# EAGLE design tm7_revA (EAGLE 9.6.2)
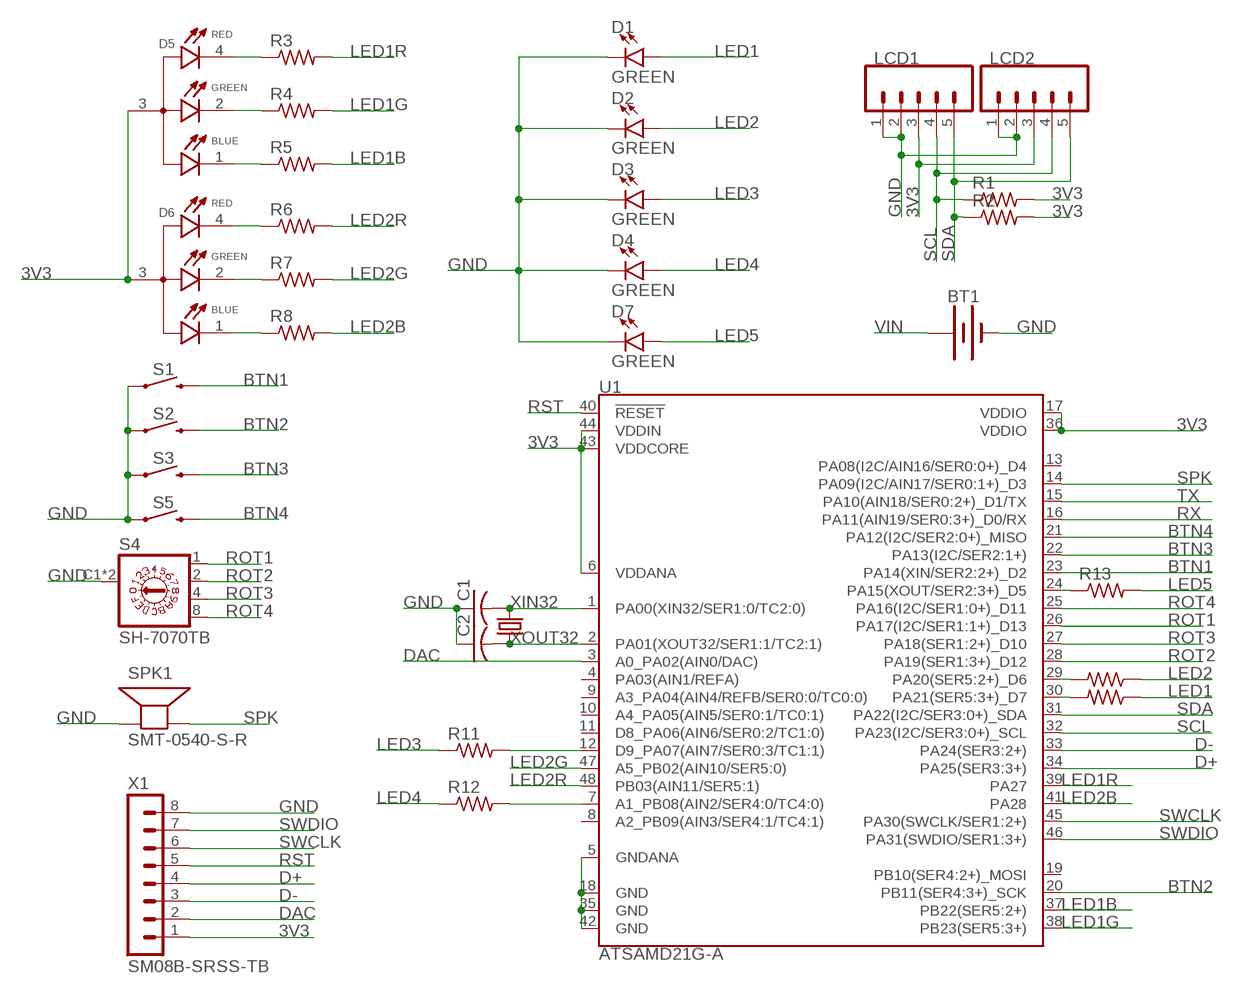
[diagram p0: schematic, sheet 1]

## Parts
BT1  BATTERY-20MM_SMD_4LEGS_OVERPASTE_INNER  [BATTCON_20MM_4LEGS_OVERPASTE_INNER]
C1  C-USC0603  [C0603]
C2  C-USC0603  [C0603]
D1  GREEN  LED-GREEN1206  [LED-1206]
D2  GREEN  LED-GREEN1206  [LED-1206]
D3  GREEN  LED-GREEN1206  [LED-1206]
D4  GREEN  LED-GREEN1206  [LED-1206]
D5  EAST1616RGBA3  [LED_EAST1616RGBA3]
D6  EAST1616RGBA3  [LED_EAST1616RGBA3]
D7  GREEN  LED-GREEN1206  [LED-1206]
LCD1  CONN_05VERT_FEMALE_HEADER  [1X05_SMD_VERTICAL_COMBO]
LCD2  CONN_05VERT_FEMALE_HEADER  [1X05_SMD_VERTICAL_COMBO]
R1  R-US_R0603  [R0603]
R2  R-US_R0603  [R0603]
R3  R-US_R0603  [R0603]
R4  R-US_R0603  [R0603]
R5  R-US_R0603  [R0603]
R6  R-US_R0603  [R0603]
R7  R-US_R0603  [R0603]
R8  R-US_R0603  [R0603]
R9  R-US_R0603  [R0603]
R10  R-US_R0603  [R0603]
R11  R-US_R0603  [R0603]
R12  R-US_R0603  [R0603]
R13  R-US_R0603  [R0603]
S1  MOMENTARY-SWITCH-SPST-SMD-6.0X3.5MM  [TACTILE_SWITCH_SMD_6.0X3.5MM]
S2  MOMENTARY-SWITCH-SPST-SMD-6.0X3.5MM  [TACTILE_SWITCH_SMD_6.0X3.5MM]
S3  MOMENTARY-SWITCH-SPST-SMD-6.0X3.5MM  [TACTILE_SWITCH_SMD_6.0X3.5MM]
S4  SH-7070TB  [SH-7070B]
S5  MOMENTARY-SWITCH-SPST-SMD-6.0X3.5MM  [TACTILE_SWITCH_SMD_6.0X3.5MM]
SPK1  SMT-0540-S-R  [SMT-0540-S-R]
U1  ATSAMD21G-A  [TQFP-48]
X1  SM08B-SRSS-TB  [SM08B-SRSS-TB]
Y1  32.768kHz  CRYSTAL-32.768KHZSMD-3.2X1.5  [CRYSTAL-SMD-3.2X1.5MM]

## Nets
3V3: D5.3(A) D6.3(A) LCD1.3 LCD2.3 R1.2 R2.2 U1.6(VDDANA) U1.17(VDDIO) U1.36(VDDIO) U1.43(VDDCORE) U1.44(VDDIN) X1.1
BTN1: S1.2 U1.23(PA14(XIN/SER2:2+)_D2)
BTN2: S2.2 U1.20(PB11(SER4:3+)_SCK)
BTN3: S3.2 U1.22(PA13(I2C/SER2:1+))
BTN4: S5.2 U1.21(PA12(I2C/SER2:0+)_MISO)
D+: U1.34(PA25(SER3:3+)) X1.4
D-: U1.33(PA24(SER3:2+)) X1.3
DAC: U1.3(A0_PA02(AIN0/DAC)) X1.2
GND: BT1.2(-) C1.1 C2.1 D1.C D2.C D3.C D4.C D7.C LCD1.1 LCD1.2 LCD2.1 LCD2.2 S1.1 S2.1 S3.1 S4.C1(C) S4.C2(C) S5.1 SPK1.-(+) U1.5(GNDANA) U1.18(GND) U1.35(GND) U1.42(GND) X1.8
LED1: D1.A R9.1
LED1B: R5.2 U1.37(PB22(SER5:2+))
LED1G: R4.2 U1.38(PB23(SER5:3+))
LED1R: R3.2 U1.39(PA27)
LED2: D2.A R10.1
LED2B: R8.2 U1.41(PA28)
LED2G: R7.2 U1.47(A5_PB02(AIN10/SER5:0))
LED2R: R6.2 U1.48(PB03(AIN11/SER5:1))
LED3: D3.A R11.1
LED4: D4.A R12.1
LED5: D7.A R13.2
N$1: R12.2 U1.7(A1_PB08(AIN2/SER4:0/TC4:0))
N$2: R11.2 U1.12(D9_PA07(AIN7/SER0:3/TC1:1))
N$3: R9.2 U1.30(PA21(SER5:3+)_D7)
N$4: R10.2 U1.29(PA20(SER5:2+)_D6)
N$5: D5.4(R_C) R3.1
N$6: D5.2(G_C) R4.1
N$7: D5.1(B_C) R5.1
N$8: D6.4(R_C) R6.1
N$9: D6.2(G_C) R7.1
N$10: D6.1(B_C) R8.1
N$11: R13.1 U1.24(PA15(XOUT/SER2:3+)_D5)
ROT1: S4.1 U1.26(PA17(I2C/SER1:1+)_D13)
ROT2: S4.2 U1.28(PA19(SER1:3+)_D12)
ROT3: S4.4 U1.27(PA18(SER1:2+)_D10)
ROT4: S4.8 U1.25(PA16(I2C/SER1:0+)_D11)
RST: U1.40(!RESET!) X1.5
RX: U1.16(PA11(AIN19/SER0:3+)_D0/RX)
SCL: LCD1.4 LCD2.4 R1.1 U1.32(PA23(I2C/SER3:0+)_SCL)
SDA: LCD1.5 LCD2.5 R2.1 U1.31(PA22(I2C/SER3:0+)_SDA)
SPK: SPK1.+(-) U1.14(PA09(I2C/AIN17/SER0:1+)_D3)
SWCLK: U1.45(PA30(SWCLK/SER1:2+)) X1.6
SWDIO: U1.46(PA31(SWDIO/SER1:3+)) X1.7
TX: U1.15(PA10(AIN18/SER0:2+)_D1/TX)
VIN: BT1.1(+)
XIN32: C1.2 U1.1(PA00(XIN32/SER1:0/TC2:0)) Y1.P$2
XOUT32: C2.2 U1.2(PA01(XOUT32/SER1:1/TC2:1)) Y1.P$1
Unconnected: U1.4(PA03(AIN1/REFA)) U1.8(A2_PB09(AIN3/SER4:1/TC4:1)) U1.9(A3_PA04(AIN4/REFB/SER0:0/TC0:0)) U1.10(A4_PA05(AIN5/SER0:1/TC0:1)) U1.11(D8_PA06(AIN6/SER0:2/TC1:0)) U1.13(PA08(I2C/AIN16/SER0:0+)_D4) U1.19(PB10(SER4:2+)_MOSI)

## Library data of the parts
BT1 = SparkFun-Batteries:BATTERY: Battery - Single Cell A variety of battery chemistries, sizes, and footprints. Device List: 20MM_PTH - Coin Cell Battery Holder - 20mm (PTH) <https://www.sparkfun.com/products/783> 20MM_PTH_KIT- Coin Cell battery Holder - 20 mm (PTH) <http://www.sparkfun.com/products/783>kit version with special mask 6.8MM_PTH - Coin Cell Battery Holder - 6.8MM(SMD) <https://www.digikey.com/product-detail/en/seiko-instruments/MS621FE-FL11E/728-1057-ND/1889208?WT.srch=1&gclid=CNOQ5a6LzdQCFZS2wAodXCkE0g> 12MM_SMD - Coin Cell Battery Holder - 12mm (SMD) <https://www.sparkfun.com/products/10592> 12MM_PTH - Coin Cell Battery Holder - 12mm (PTH) <https://www.sparkfun.com/products/7948> 20MM_SMD - 20mm Coin Cell Battery Holder (SMD) (2 legs) Used on the Big Time Watch Kit <https://www.sparkfun.com/products/11734> 20MM_SMD_4LEGS - Coin Cell Battery Holder - 20mm (SMD) <https://www.sparkfun.com/products/11892> 20MM_SMD_4LEGS_OVERPASTE - Coin Cell Battery Holder - 20mm (SMD) <https://www.sparkfun.com/products/11892> (Over-paste on the legs) 24.5MM_PTH - Coin Cell Battery Holder - 24.5mm (PTH) <https://www.sparkfun.com/products/8863> 9V - 9V Battery Holder - PC Mount Used on the SparkFun SparkPunk Sound Kit <https://www.sparkfun.com/products/11177> and SparkFun SparkPunk Sequencer Kit <https://www.sparkfun.com/products/12707> 18650 - Battery Holder - 18650 (PTH) <https://www.sparkfun.com/products/13113> AA - Battery Holder - 1xAA (PTH) <https://www.sparkfun.com/products/7949> AAA - Battery Holder - 1xAAA (PTH) <https://www.sparkfun.com/products/12718> AA_KIT - Battery Holder - 1xAA (PTH) <https://www.sparkfun.com/products/7949> Special kit package - pads only have exposed copper on one side of the board. AAA_KIT - Battery Holder - 1xAAA (PTH) <https://www.sparkfun.com/products/12718> Special kit package - pads only have exposed copper on one side of the board.
C1 C2 = adafruit:C-US: CAPACITOR, American symbol
D1-D4 D7 = SparkFun-LED:LED-GREEN: Green SMD LED Used in manufacturing of various products at SparkFun Packages: 0603 - SMD 0603 package [Product Link] <http://www.futureelectronics.com/en/technologies/semiconductors/optoelectronics/leds/Pages/9894312-LTST-C190GKT.aspx?CrossPart=HSMG-C190&IM=0> LilyPad 1206 - SMD1206 LilyPad package [Product Link] <http://www.futureelectronics.com/en/Technologies/Product.aspx?ProductID=IN150NGHARVATEKCORPORATION2049943&IM=0> 1206 - SMD1206 package [Product Link] <http://www.futureelectronics.com/en/technologies/semiconductors/optoelectronics/leds/Pages/8315665-LTST-C150KGKT.aspx?IM=0> 1206 Bottom Mount -SMD 1206 Bottom Mount [Product Link] <http://www.digikey.com/product-detail/en/lite-on-inc/LTST-C230KGKT/160-1456-1-ND/386854> SparkFun Products: Pro Mini 328 -5V <https://www.sparkfun.com/products/821> RedBoard <https://www.sparkfun.com/products/12757> MP3 Trigger <https://www.sparkfun.com/products/13720> Makey Makey <https://www.sparkfun.com/products/11076>; PROD_ID: DIO-00862
D5 D6 = EAST1616RGBA3:EAST1616RGBA3: Red, Green, Blue (RGB) LED Indication - Discrete 1.95V Red, 2.8V Green, 2.8V Blue 0606 (1616 Metric) Check availability <https://pricing.snapeda.com/parts/EAST1616RGBA3/Everlight%20Electronics/view-part?ref=eda>; AVAILABILITY: In Stock; DESCRIPTION: Red, Green, Blue (RGB) - LED Indication - Discrete 1.95V Red, 2.8V Green, 2.8V Blue 0606 (1616 Metric); MF: Everlight Electronics; MP: EAST1616RGBA3; PACKAGE: 0606 Everlight; PRICE: None; PURCHASE-URL: https://pricing.snapeda.com/search/part/EAST1616RGBA3/?ref=eda
LCD1 LCD2 = SparkFun-Connectors:CONN_05: Multi connection point. Often used as Generic Header-pin footprint for 0.1 inch spaced/style header connections On any of the 0.1 inch spaced packages, you can populate with these: Break Away Headers - Straight <https://www.sparkfun.com/products/116> (PRT-00116) Break Away Male Headers - Right Angle <https://www.sparkfun.com/products/553> (PRT-00553) Female Headers <https://www.sparkfun.com/products/115> (PRT-00115) Break Away Headers - Machine Pin <https://www.sparkfun.com/products/117> (PRT-00117) Break Away Female Headers - Swiss Machine Pin <https://www.sparkfun.com/products/743> (PRT-00743) For SCREWTERMINALS and SPRING TERMINALS visit here: Screw Terimnals on SparkFun.com <https://www.sparkfun.com/search/results?term=Screw+Terminals> (5mm/3.5mm/2.54mm spacing) This device is also useful as a general connection point to wire up your design to another part of your project. Our various solder wires solder well into these plated through hole pads. Hook-Up Wire - Assortment (Stranded, 22 AWG) <https://www.sparkfun.com/products/11375> (PRT-11375) Hook-Up Wire - Assortment (Solid Core, 22 AWG) <https://www.sparkfun.com/products/11367> (PRT-11367) View the entire wire category on our website here <https://www.sparkfun.com/categories/141> Special notes: Molex polarized connector foot print use with SKU : PRT-08231 with associated crimp pins and housings. 1MM SMD Version SKU: PRT-10208; PROD_ID: CONN-15262
R1-R13 = rcl:R-US_: RESISTOR, American symbol; SPICEPREFIX: R
S1-S3 S5 = SparkFun-Switches:MOMENTARY-SWITCH-SPST: Momentary Switch (Pushbutton) - SPST Normally-open (NO) SPST momentary switches (buttons, pushbuttons). Variants PTH-12MM - 12mm square, through-hole Momentary Pushbutton Switch - 12mm Square <https://www.sparkfun.com/products/9190> (COM-09190) PTH-6.0MM, PTH-6.0MM-KIT - 6.0mm square, through-hole Mini Pushbutton Switch <https://www.sparkfun.com/products/97> (COM-00097) KIT package intended for soldering kit's - only one side of pads' copper is exposed. PTH-RIGHT-ANGLE-KIT - Right-angle, through-hole Right Angle Tactile Button <https://www.sparkfun.com/products/10791> - Used on SparkFun BigTime Watch Kit <https://www.sparkfun.com/products/11734> SMD-12MM - 12mm square, surface-mount Tactile Button - SMD (12mm) <https://www.sparkfun.com/products/12993> (COM-12993) Used on SparkFun PicoBoard <https://www.sparkfun.com/products/11888> SMD-4.5MM - 4.5mm Square Trackball Switch Used on SparkFun Blackberry Trackballer Breakout <https://www.sparkfun.com/products/13169> SMD-4.6MMX2.8MM - 4.60mm x 2.80mm, surface mount Used on SparkFun Pro Micro - RP2040 <https://www.sparkfun.com/products/17717> SMD-5.2MM, SMD-5.2-REDUNDANT - 5.2mm square, surface-mount Mini Pushbutton Switch - SMD <https://www.sparkfun.com/products/8720> (COM-08720) Used on Arduino Pro Mini <https://www.sparkfun.com/products/11114> REDUNDANT package connects both switch circuits together SMD-6.0X3.5MM - 6.0 x 3.5mm, surface mount Momentary Reset Switch SMD <https://www.sparkfun.com/products/8229> (COM-08229) SMD-6.2MM-TALL - 6.2mm square, surface mount Tactile Button - SMD (6mm) <https://www.sparkfun.com/products/12992> Used on SparkFun Digital Sandbox <https://www.sparkfun.com/products/12651> SMD-RIGHT-ANGLE - Right-angle, surface mount Used on SparkFun Block for Intel® Edison - Arduino <https://www.sparkfun.com/products/13036>; PROD_ID: SWCH-14278; SF_SKU: COM-08229
S4 = SH-7070TB:SH-7070TB: ROTARY CODED HEX SWITCH Check availability <https://pricing.snapeda.com/parts/SH-7070TB/Nidec%20Copal/view-part?ref=eda>; AVAILABILITY: In Stock; DESCRIPTION: Dip Switch Hexadecimal Complement 16 Position Surface Mount Rotary for Tool Actuator 100mA 5VDC; MF: Nidec Copal; MP: SH-7070TB; PACKAGE: None; PRICE: None; PURCHASE-URL: https://pricing.snapeda.com/search/part/SH-7070TB/?ref=eda
SPK1 = SMT-0540-S-R:SMT-0540-S-R: SMT-0549-S-R Small surface-mount magnetic buzzer Check availability <https://pricing.snapeda.com/parts/SMT-0540-S-R/PUI/view-part?ref=eda>; AVAILABILITY: In Stock; DESCRIPTION: SURFACE MOUNT TRANSDUCER 3V0-P 100MA; MF: PUI; MP: SMT-0540-S-R; PACKAGE: None; PRICE: None; PURCHASE-URL: https://pricing.snapeda.com/search/part/SMT-0540-S-R/?ref=eda
U1 = SparkFun-IC-Microcontroller:ATSAMD21G: Atmel SAMD21G SMART ARM-Based Microcontroller The Atmel ® | SMART ™ SAM D21 is a series of low-power microcontrollers using the 32-bit ARM ® Cortex ® -M0+ processor, and ranging from 32- to 64-pins with up to 256KB Flash and 32KB of SRAM. The SAM D21 devices operate at a maximum frequency of 48MHz and reach 2.46 CoreMark/MHz. They are designed for simple and intuitive migration with identical peripheral modules, hex compatible code, identical linear address map and pin compatible migration paths between all devices in the product series. All devices include intelligent and flexible peripherals, Atmel Event System for inter-peripheral signaling, and support for capacitive touch button, slider and wheel user interfaces. Datasheet <https://cdn.sparkfun.com/datasheets/Dev/Arduino/Boards/Atmel-42181-SAM-D21_Datasheet.pdf> SparkFun Products SparkFun SAMD21 Mini Breakout <https://www.sparkfun.com/products/13664> (DEV-13664) SparkFun SAMD21 Dev Breakout <https://www.sparkfun.com/products/13672> (DEV-13672) (DEV-14926); PROD_ID: IC-13064
X1 = con-JST:SM08B-SRSS: JST SH series header 1.00mm pitch disconnectable crimp style connectors, horizontal (side entry type), 8 pins
Y1 = SparkFun-Clocks:CRYSTAL-32.768KHZ: 32.768kHz Crystal Frequency: 32.768kHz Frequency Stability: ±20ppm Load Capacitance: 12.5pF (PTH-2X6 & SMD-3.2X1.5), 6pF (SMD-2X6) SparkFun Products: SparkFun BigTime Watch Kit <https://www.sparkfun.com/products/11734> SparkFun nRF52832 Breakout <https://www.sparkfun.com/products/13990> SparkFun Real Time Clock Module <https://www.sparkfun.com/products/12708>; PROD_ID: XTAL-13062

## Board
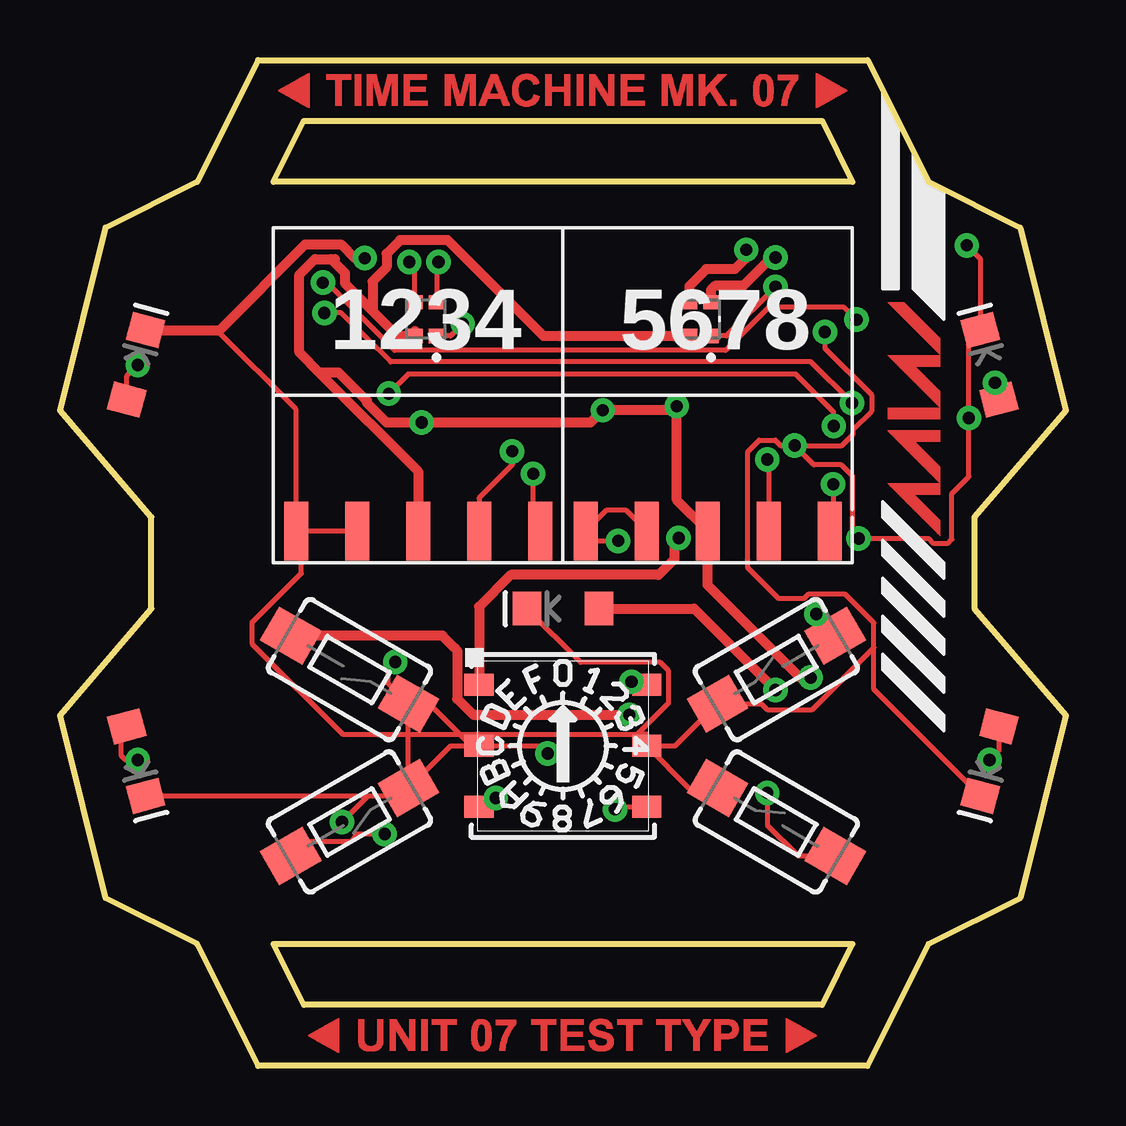
[diagram p1: board, top side]
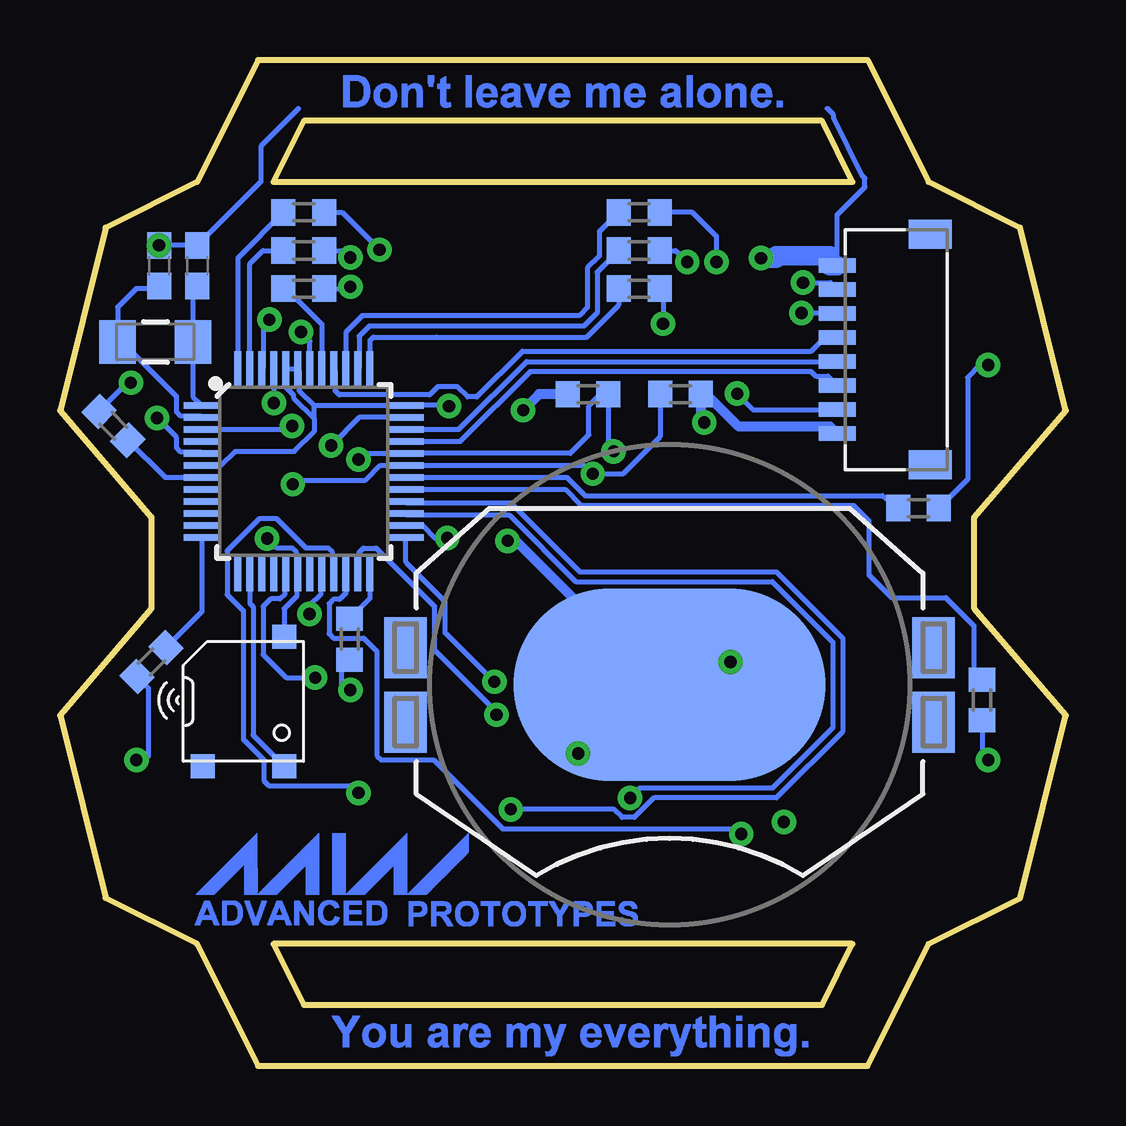
[diagram p2: board, bottom side, seen from below]

Size 41.91 x 41.91 mm. Coordinates in mm from the lower left corner, seen from the top.
Outline: 33.66,0 8.25,0 5.71,5.08 1.9,6.98 0,14.61 3.81,19.05 3.81,22.86 0,27.3 1.9,34.92 5.71,36.83 8.25,41.91 33.66,41.91 36.19,36.83 40,34.92 41.91,27.3 38.1,22.86 38.1,19.05 41.91,14.61 40,6.98 36.19,5.08 33.66,0
Outline: 8.89,36.83 10.16,39.37 31.75,39.37 33.02,36.83 8.89,36.83
Outline: 33.02,5.08 31.75,2.54 10.16,2.54 8.89,5.08 33.02,5.08
Copper layers (1*16): Top 0.035mm / dielectric 1.5mm / Bottom 0.035mm
Design rules "SparkFun": minimum track width 8mil, minimum drill 20mil, track to track 8mil, track to pad 8mil, pad to pad 8mil, via to via 8mil, smd to smd 8mil, copper to edge 10mil, drill to drill 8mil, minimum pad ring 12mil, minimum via ring 10mil, stop-mask expansion 4mil, vias tented up to drill 25mil, thermal gap 10mil

### Footprints (pad centres in the part's own frame; a part is rotated, then mirrored left to right if it is on the bottom)
BATTCON_20MM_4LEGS_OVERPASTE_INNER = smd 1.778 x 2.54: 1 -11,1.55; 3 11,1.55; P$1 -11,-1.55; P$2 11,-1.55 | smd 13 x 8: 2 0,0
C0603 = smd 1.1 x 1: 1 -0.85,0; 2 0.85,0
LED-1206 = smd 1.2 x 1.4: A -1.5,0; C 1.5,0
LED_EAST1616RGBA3 = smd 0.6 x 0.65: 1 0.7,0.45; 2 -0.7,0.45; 3 0.7,-0.45; 4 -0.7,-0.45
1X05_SMD_VERTICAL_COMBO = smd 1 x 2.438: 1 0,1.65; 2 2.54,1.65; 3 5.08,1.65; 4 7.62,1.652; 5 10.16,1.65
R0603 = smd 1 x 1.1: 1 -0.85,0; 2 0.85,0
TACTILE_SWITCH_SMD_6.0X3.5MM = smd 2.032 x 1.626: 1 -2.833,0; 2 2.833,0
SH-7070B = smd 1.219 x 0.914: 1 -2.223,3.81; 2 4.763,-1.27; 4 -2.223,-1.27; 8 4.763,3.81; C1 -2.223,1.27; C2 4.763,1.27
SMT-0540-S-R = smd 1 x 1: + 1.7,-2.7; - 1.7,2.7; M -1.7,-2.7
TQFP-48 = smd 1.5 x 0.28: 1 -4.25,2.75; 2 -4.25,2.25; 3 -4.25,1.75; 4 -4.25,1.25; 5 -4.25,0.75; 6 -4.25,0.25; 7 -4.25,-0.25; 8 -4.25,-0.75; 9 -4.25,-1.25; 10 -4.25,-1.75; 11 -4.25,-2.25; 12 -4.25,-2.75; 25 4.25,-2.75; 26 4.25,-2.25; 27 4.25,-1.75; 28 4.25,-1.25; 29 4.25,-0.75; 30 4.25,-0.25; 31 4.25,0.25; 32 4.25,0.75; 33 4.25,1.25; 34 4.25,1.75; 35 4.25,2.25; 36 4.25,2.75 | smd 0.28 x 1.5: 13 -2.75,-4.25; 14 -2.25,-4.25; 15 -1.75,-4.25; 16 -1.25,-4.25; 17 -0.75,-4.25; 18 -0.25,-4.25; 19 0.25,-4.25; 20 0.75,-4.25; 21 1.25,-4.25; 22 1.75,-4.25; 23 2.25,-4.25; 24 2.75,-4.25; 37 2.75,4.25; 38 2.25,4.25; 39 1.75,4.25; 40 1.25,4.25; 41 0.75,4.25; 42 0.25,4.25; 43 -0.25,4.25; 44 -0.75,4.25; 45 -1.25,4.25; 46 -1.75,4.25; 47 -2.25,4.25; 48 -2.75,4.25
SM08B-SRSS-TB = smd 0.6 x 1.55: 1 3.5,0; 2 2.5,0; 3 1.5,0; 4 0.5,0; 5 -0.5,0; 6 -1.5,0; 7 -2.5,0; 8 -3.5,0 | smd 1.2 x 1.8: M1 4.8,3.875; M2 -4.8,3.875
CRYSTAL-SMD-3.2X1.5MM = smd 1.524 x 1.8: P$1 -1.567,0; P$2 1.567,0

### Placement (x,y rotation side)
BT1  16.51,15.88 0 bottom
C1  36.19,33.34 270 bottom
C2  37.78,33.34 270 bottom
D1  3.18,29.21 75 top
D2  3.18,12.7 285 top
D3  38.73,12.7 255 top
D4  38.73,29.21 105 top
D5  15.24,31.12 270 top
D6  26.67,31.12 270 top
D7  20.96,19.05 180 top
LCD1  9.84,20.64 0 top
LCD2  21.91,20.64 0 top
R1  19.91,27.98 180 bottom
R2  16.06,27.99 0 bottom
R3  17.78,35.56 180 bottom
R4  17.78,33.97 180 bottom
R5  17.78,32.38 180 bottom
R6  31.75,35.56 180 bottom
R7  31.75,33.97 180 bottom
R8  31.75,32.38 180 bottom
R9  6.14,23.24 180 bottom
R10  3.49,15.24 90 bottom
R11  38.1,16.83 45 bottom
R12  39.69,26.67 315 bottom
R13  29.85,17.78 270 bottom
S1  12.06,16.51 150 top
S2  29.85,16.51 30 top
S3  12.06,10.16 210 top
S4  19.68,12.07 0 top
S5  29.85,10.16 330 top
SPK1  34.27,15.18 0 bottom
U1  31.75,24.77 0 bottom
X1  9.52,29.84 270 bottom
Y1  37.94,30.16 0 bottom

### Tracks (layer width: path | path; a pad name or v marks a point on that pad's centre or on a via)
3V3  (via drill 0.51)
  Top 0.203: 14.66,30.41 D5.3 | v31.28,16.17 30.84,16.17
  Top 0.406: 11.3,33.62 10.62,33.62 9.97,32.97 9.97,29.72 10.81,28.89 | 11.3,33.62 11.46,33.62 | 10.81,28.89 14.92,24.77 LCD1.3 | 30.84,16.17 26.99,20.03 LCD2.3 25.7,23.58 v25.7,27.49 25.53,27.32 v22.61,27.32 22.1,26.8 v15.07,26.8 13.61,26.8 12.78,27.63 12.78,27.72 11.61,28.89 10.81,28.89 | 14.79,30.62 D5.3 14.06,30.41 13.03,31.45 | D6.3 20.14,30.41 16.15,34.4 14.18,34.4 13.61,33.84 13.61,33.28 13.03,32.69 13.03,31.45 | 11.3,33.62 11.87,33.05 11.87,32.61 13.03,31.45
  Bottom 0.203: v25.7,27.49 25.87,27.49 25.9,27.52 U1.36 31.32,27.52 | 32.5,19.83 U1.17 32.55,20.46 32.55,19.64 32.73,19.46 33.13,19.46 33.44,19.14 33.44,17.14 32.48,16.17 v31.28,16.17 | 31.32,27.52 31.94,28.14 31.94,28.96 U1.43 U1.44 32.5,28.27 32.19,27.96 32.19,27.84 31.32,26.98 | 31.32,26.98 31.32,26.42 32.14,25.6 34.61,25.6 35.2,25.02 U1.6 | 31.32,26.98 31.32,27.52
  Bottom 0.406: R1.2 21.95,27.98 v22.61,27.32 | X1.1 9.82,26.64 13.62,26.64 14.97,27.99 R2.2 15.21,26.94 v15.07,26.8
BTN1  (via drill 0.51)
  Top 0.203: 16.45,17.41 16.55,17.31
  Top 0.406: v23.72,14.63 17.21,14.63 16.55,15.29 16.55,17.31 | S1.2 15.93,17.93 16.45,17.41
  Bottom 0.203: v23.72,14.63 23.72,14.74 26.32,17.33 26.32,19.15 28.73,21.57 29.27,21.57 29.44,21.39 29.44,20.57 U1.23
BTN2  (via drill 0.51)
  Top 0.203: v31.51,18.83 32.3,18.05 S2.2
  Bottom 0.203: U1.20 31.05,20.46 31.05,19.64 31.51,19.18 v31.51,18.83
BTN3  (via drill 0.51)
  Top 0.203: v13.53,9.66 12.39,9.66 12.08,9.35 10.21,9.35 S3.2
  Bottom 0.203: v13.53,9.66 13.74,9.87 23.46,9.87 26.34,12.75 28.53,12.75 28.7,12.93 28.7,17.27 29.26,17.82 30.52,17.82 30.7,18 30.7,19.26 30.52,19.43 30.26,19.43 30,19.69 U1.22
BTN4  (via drill 0.51)
  Top 0.203: v29.47,11.37 29.47,10.03 30.75,8.74 S5.2
  Bottom 0.203: U1.21 30.55,20.57 30.55,21.39 30.73,21.57 31.66,21.57 32.88,22.79 33.61,22.79 34.94,21.46 34.94,19.64 34.27,18.96 34.27,13.6 33.41,12.74 33.41,11.89 33.2,11.68 29.78,11.68 v29.47,11.37
D+
  Bottom 0.203: U1.34 25.3,26.52 22.47,29.34 X1.4
D-
  Bottom 0.203: U1.33 25.23,26.02 22.3,28.94 10.62,28.94 10.43,28.74 9.92,28.74 X1.3
DAC  (via drill 0.51)
  Top 0.203: v32.24,26.66 32.24,27.24 30.66,28.82 14.51,28.82 v13.7,28.01
  Bottom 0.203: U1.3 32.38,26.52 v32.24,26.66 | v13.7,28.01 13.04,27.34 X1.2
GND  (via drill 0.51)
  Top 0.203: v31.87,30.58 31.87,29.9 33.81,27.96 33.81,27.28 33.05,26.52 33.05,26.32 32.58,25.84 v30.61,25.84 | LCD2.2 23.59,23.15 22.76,23.15 LCD2.1 22.32,21.87 v23.26,21.87 | LCD1.1 LCD1.2 12.77,22.29 | C2.1 38.35,33.62 D4.C 37.87,30.18 v37.87,26.99 37.87,24.55 37.16,23.84 37.16,21.94 36.98,21.76 36.41,21.76 36.19,21.98 v33.28,21.98 33.03,22.23 33.03,24.57 32.55,25.04 31.41,25.04 v30.61,25.84 | S4.C2 25.63,13.34 S2.1 29.23,15.09 29.48,14.85 31.33,14.85 33.91,17.42 | S3.1 14.52,14.92 | 14.52,14.92 S1.1 13.65,15.96 13.65,16.51 v13.97,16.83 | S3.1 16.28,13.34 S4.C1 | D2.C 12.84,11.25 | S3.1 14.19,11.25 12.84,11.25 | v30.61,25.84 30.04,25.84 29.81,26.07 29.13,26.07 28.66,25.6 28.66,20.75 29.94,19.46 31,19.46 31.18,19.64 32.73,19.64 33.91,18.46 33.91,17.42 | 17.46,13.82 11.78,13.82 8,17.59 8,18.46 10.06,20.52 10.06,22.07 LCD1.1 | 17.46,13.82 24.06,13.82 | 24.06,13.82 25.36,15.12 25.36,16.46 25.01,16.82 21.69,16.82 D7.C | S4.C1 17.46,13.82 | S4.C2 24.45,13.82 24.06,13.82 | 14.52,14.92 15.56,14.92 17.14,13.34 S4.C1 | S4.C1 20,13.34 v20.32,13.02 | v11.75,10.16 12.84,11.25 | S4.C2 26.21,11.58 S5.1 | 38.02,11.58 D3.C 33.91,15.69 33.91,17.42 | LCD1.1 9.84,27.35 6.53,30.66 D1.C
  Top 0.406: v12.7,33.66 12.29,33.66 11.71,34.23 10.22,34.23 6.65,30.66 D1.C
  Bottom 0.203: U1.42 31.5,30.2 v31.87,30.58 | X1.8 9.52,35.46 8.37,36.61 8.37,36.99 8.49,37.12 9.68,39.48 9.68,39.62 9.94,39.89 | 31.97,39.89 33.54,38.32 33.54,36.84 C1.1 C2.1 | U1.5 36.05,25.57 36.88,25.57 37.05,25.75 37.05,26.18 v37.87,26.99 | v33.28,21.98 32.87,21.57 32.23,21.57 32.05,21.39 32.05,20.57 U1.18 32.05,20.46 32.05,19.56 32.57,19.05 SPK1.- | U1.35 29.44,27.02 v30.61,25.84 | 15.24,15.24 15.87,15.88 BT1.2 15.56,16.83 v13.97,16.83
  Bottom 0.406: v23.26,21.87 22.91,21.87 18.63,17.59 18.22,17.59 BT1.2
  Bottom 0.813: X1.8 9.84,33.34 9.84,33.75 12.07,33.75 12.07,33.66 v12.7,33.66
  other vias: 37.78,34.19
LED1  (via drill 0.51)
  Top 0.203: D1.A 2.79,28.75 v3.24,29.2
  Bottom 0.203: v3.24,29.2 3.58,29.2 4.1,28.69 4.1,24.44 R9.1
LED1B
  Bottom 0.203: R5.2 18.63,31.7 19.97,30.36 26.21,30.36 28.86,30.36 29,30.22 U1.37
LED1G
  Bottom 0.203: U1.38 29.44,29.07 29.44,30.41 29.03,30.82 20.08,30.82 19.53,31.38 19.53,33.08 R4.2
LED1R
  Bottom 0.203: U1.39 30,30.56 29.29,31.27 20.26,31.27 19.93,31.6 19.93,33.24 19.43,33.74 19.43,34.76 R3.2
LED2  (via drill 0.51)
  Top 0.203: v3.24,12.74 2.72,12.74 2.55,12.92 2.55,13.91 D2.A
  Bottom 0.203: R10.1 3.49,13 v3.24,12.74
LED2B
  Bottom 0.203: R8.2 32.48,32.38 31,30.91 U1.41
LED2G
  Bottom 0.203: U1.47 34,33.43 33.46,33.97 R7.2
LED2R
  Bottom 0.203: R6.2 34.5,33.66 U1.48
LED3  (via drill 0.51)
  Top 0.203: D3.A 39.12,13.14 v38.73,12.74
  Bottom 0.203: v38.73,12.74 38.39,12.74 38.21,12.92 38.21,15.74 R11.1
LED4  (via drill 0.51)
  Top 0.203: D4.A 39.12,28.3 v38.96,28.46
  Bottom 0.203: v38.96,28.46 39.1,28.46 R12.1
LED5  (via drill 0.51)
  Top 0.406: D7.A 26.42,19.05 v29.81,15.66
  Bottom 0.203: v29.81,15.66 29.98,15.66 30.19,15.86 30.19,16.59 R13.2
N$1
  Bottom 0.203: R12.2 37.53,24.52 U1.7
N$2
  Bottom 0.203: U1.12 36,18.93 R11.2
N$3
  Bottom 0.203: U1.30 20.79,24.52 20.03,23.76 7.64,23.76 R9.2
N$4
  Bottom 0.203: U1.29 20.86,24.02 20.2,23.35 8.85,23.35 8.21,22.72 8.21,20.46 7.26,19.51 5,19.51 3.84,18.34 3.84,16.43 R10.2
N$5  (via drill 0.51)
  Top 0.203: D5.4 14.79,33.25 v14.55,33.49
  Bottom 0.203: v14.55,33.49 14.55,34.56 15.56,35.56 R3.1
N$6  (via drill 0.51)
  Top 0.203: v15.77,33.49 15.69,33.41 D5.2
  Bottom 0.203: R4.1 16.26,33.97 v15.77,33.49
N$7  (via drill 0.51)
  Top 0.203: v16.78,30.92 16.28,30.41 D5.1
  Bottom 0.203: R5.1 16.78,32.24 v16.78,30.92
N$8  (via drill 0.51)
  Top 0.406: v28.59,34 28.59,33.66 28.12,33.19 26.93,33.19 26.22,32.48 D6.4
  Bottom 0.203: R6.1 30.15,35.56 v28.59,34
N$9  (via drill 0.51)
  Top 0.406: v29.81,33.68 29.64,33.68 28.46,32.5 27.29,32.5 27.12,32.33 D6.2
  Bottom 0.203: R7.1 30.11,33.97 v29.81,33.68
N$10  (via drill 0.51)
  Top 0.203: v29.81,32.46 27.77,30.41 D6.1
  Bottom 0.203: R8.1 29.89,32.38 v29.81,32.46
N$11
  Bottom 0.203: U1.24 29,19.48 R13.1
ROT1  (via drill 0.51)
  Top 0.406: v25.78,21.99 25.6,21.81 25.6,21.11 24.94,20.46 18.79,20.46 17.46,19.13 S4.1
  Bottom 0.203: U1.26 26.81,22.52 26.29,21.99 v25.78,21.99
ROT2  (via drill 0.51)
  Top 0.203: v23.13,10.69 23.23,10.8 S4.2
  Bottom 0.203: U1.28 27.44,23.46 23.12,23.46 20.25,20.59 12.06,20.59 9.3,17.83 9.3,13.92 12.06,11.16 17.16,11.16 17.98,10.35 18.49,10.35 18.83,10.69 v23.13,10.69
ROT3  (via drill 0.51)
  Top 0.203: S4.4 17.83,11.16 v18.15,11.16
  Bottom 0.203: U1.27 27.44,22.96 23.19,22.96 20.42,20.18 12.23,20.18 9.7,17.66 9.7,14.09 12.23,11.57 17.75,11.57 v18.15,11.16
ROT4  (via drill 0.51)
  Top 0.203: S4.8 23.94,15.88 v23.81,16
  Bottom 0.203: v23.81,16 25.87,18.06 25.87,19.36 27.5,20.99 U1.25
RST
  Bottom 0.203: X1.5 10.04,30.34 10.61,29.78 22.63,29.78 24.54,27.87 24.93,27.87 25.36,28.3 26.16,28.3 26.5,27.96 30.27,27.96 30.44,28.14 30.44,28.96 U1.40
SCL  (via drill 0.51)
  Top 0.203: v29.47,25.26 29.53,25.2 LCD2.4 | LCD1.4 17.46,23.66 18.84,25.04 v18.84,25.6
  Bottom 0.203: v29.47,25.26 29.22,25.52 U1.32 20.64,25.52 19.87,26.29 19.87,27.5 19.4,27.98 R1.1 19.06,25.82 v18.84,25.6
SDA  (via drill 0.51)
  Top 0.203: v32.21,24.23 32.21,22.43 LCD2.5 | LCD1.5 19.71,22.58 v19.71,24.67
  Bottom 0.203: v32.21,24.23 32.04,24.4 29.18,24.4 28.57,25.02 U1.31 20.06,25.02 v19.71,24.67 18.45,24.67 16.91,26.21 R2.1
SPK
  Bottom 0.203: U1.14 34,19.27 33.86,19.13 33.86,13.78 SPK1.+
SWCLK  (via drill 0.51)
  Top 0.203: v33,27.62 31.29,29.33 13.77,29.33 11.71,31.37 v11.01,31.37
  Bottom 0.203: U1.45 v33,27.62 | v11.01,31.37 9.55,31.37 X1.6
SWDIO  (via drill 0.51)
  Top 0.203: v33.19,31.09 32.67,31.6 29.53,31.6 27.74,29.81 13.95,29.81 11.12,32.63 v10.95,32.63
  Bottom 0.203: U1.46 33.44,29.07 33.44,30.83 v33.19,31.09 | v10.95,32.63 9.81,32.63 X1.7
XIN32
  Bottom 0.203: C1.2 36.37,32.31 Y1.P$2 36.37,27.89 U1.1
XOUT32
  Bottom 0.203: C2.2 37.89,32.38 38.73,32.38 39.51,31.61 Y1.P$1 39.34,30.16 37.05,27.88 37.05,27.25 36.88,27.07 36.05,27.07 U1.2
(copper drawn outside any net)
  shapes: Bottom area x9961, Top area x7499

### Text on the board
tPlace: 1234 | 5678